# Altium project ArgoFC.PrjPcb (part 3 of 3)

## Sheet BatteryManagementSystem.SchDoc
size A4; SheetNumber: 8; SheetTotal: 13
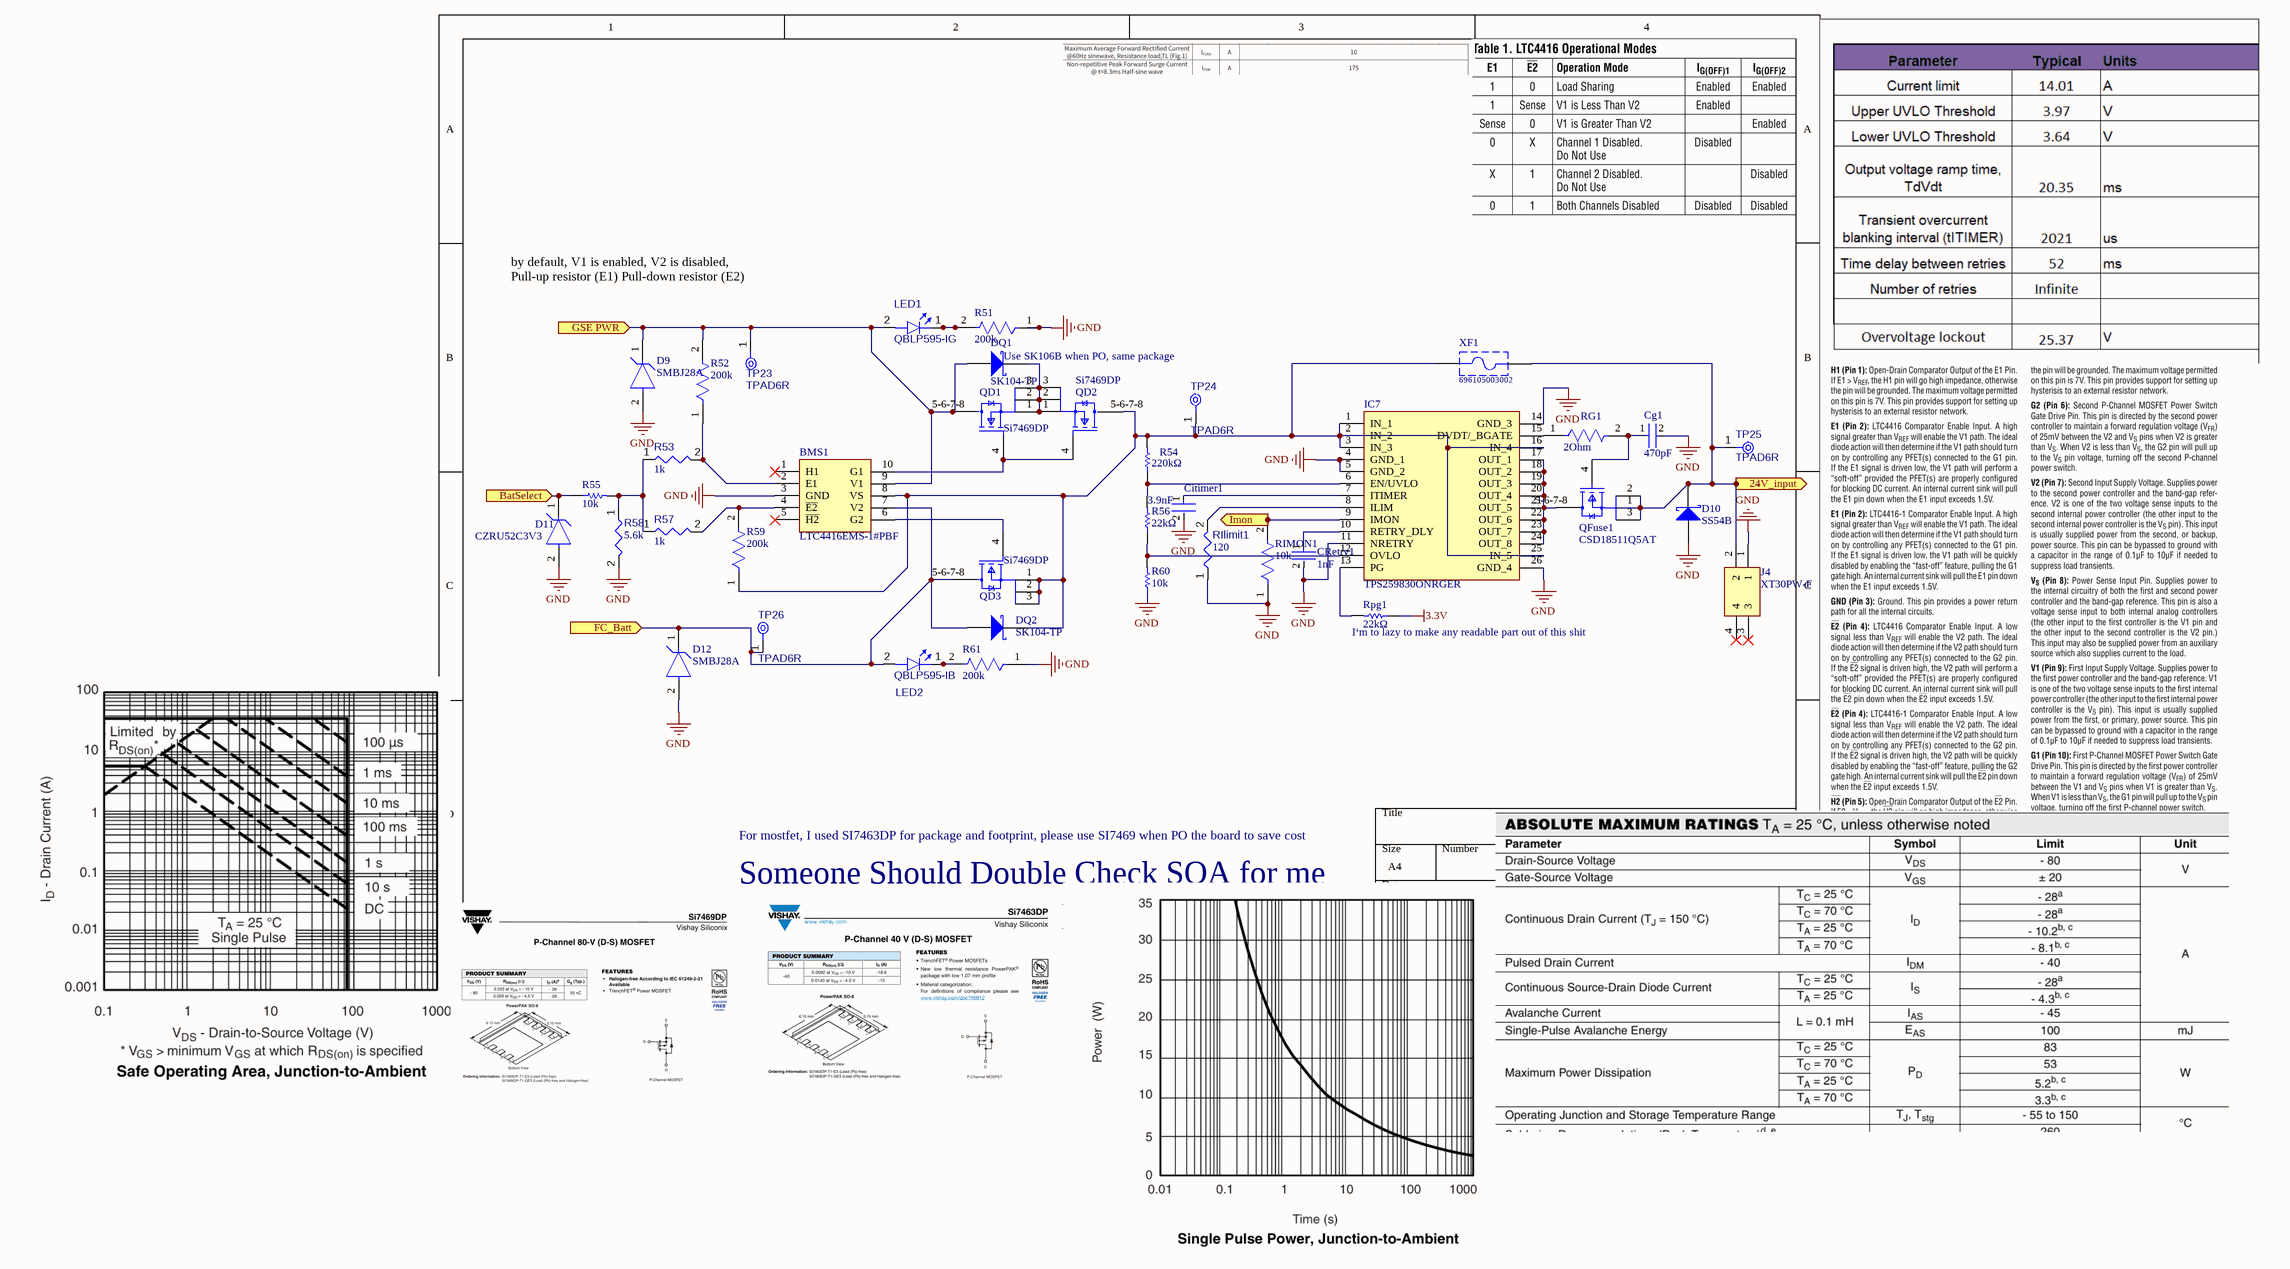
[diagram p11: BatteryManagementSystem.SchDoc]

### Parts
BMS1  LTC4416EMS-1#PBF  [SOP50P490X110-10N]
Cg1  470pF  [FP-CC0603-DA-MFG]
Citimer1  3.9nF  [FP-CC0603-DA-MFG]
CRetry1  1nF  [FP-0603-L_1_6_0_15-W_0_81-IPC_A]
D9  SMBJ28A  [FP-SMBJ-MFG]
D10  SS54B  [JCET-SMB-2_M]
D11  CZRU52C3V3  [FP-0603-SOD-523F-MFG]
D12  SMBJ28A  [FP-SMBJ-MFG]
DQ1  SK104-TP  [MCC-DO-214AB-2_V]
DQ2  SK104-TP  [MCC-DO-214AB-2_V]
IC7  TPS259830ONRGER  [TPS259830ONRGER]
J4  XT30PW-F  [XT30PWF]
LED1  QBLP595-IG  [QTB-QBLP595_V]
LED2  QBLP595-IB  [QTB-QBLP595_V]
QD1  Si7469DP  [FP-S17-0173-SINGLE-MFG]
QD2  Si7469DP  [FP-S17-0173-SINGLE-MFG]
QD3  Si7469DP  [FP-S17-0173-SINGLE-MFG]
QFuse1  CSD18511Q5AT  [FP-DQJ0008A-MFG]
R51  200k  [FP-RC0603-0_55-IPC_B]
R52  200k  [FP-RC0603-0_55-IPC_B]
R53  value 1k  [RESC1608X55X25ML10T15]  (hidden comment: Resistor 1k +/-1% 0603 100 mW)
R54  220kΩ  [RESC1608X55X30ML20T20]
R55  10k  [RESC1609X55X30LL15T15]
R56  22kΩ  [RESC1609X50X30ML10T20]
R57  value 1k  [RESC1608X55X25ML10T15]  (hidden comment: Resistor 1k +/-1% 0603 100 mW)
R58  value 5.6k  [RESC1608X55X25ML10T15]  (hidden comment: Resistor 10k +/-1% 0603 100 mW)
R59  200k  [FP-RC0603-0_55-IPC_B]
R60  10k  [RESC1609X55X30LL15T15]
R61  200k  [FP-RC0603-0_55-IPC_B]
RG1  2Ohm  [FP-CRCW2512-e3-IPC_C]
RIlimit1  value 120  [RESC0603(1608)_L]  (hidden comment: Resistor 120R +/-5 % 0603 0.1 W)
RIMON1  10k  [FP-CRCW0805-e3-IPC_A]
Rpg1  22kΩ  [RESC1609X50X30ML10T20]
TP23  TPAD6R  [TP06R]  (no BOM)
TP24  TPAD6R  [TP06R]  (no BOM)
TP25  TPAD6R  [TP06R]  (no BOM)
TP26  TPAD6R  [TP06R]  (no BOM)
XF1  696105003002  [696105003002]

### Ports
24V_input (out), BatSelect (in), FC_Batt (in), GSE PWR (in), Imon (out)

### Nets
3.3V: Rpg1.1  [project net STM32VDD]
GND: BMS1.3(GND) Cg1.2 Citimer1.2 CRetry1.2 D9.2(A) D10.1(A) D11.2(A) D12.2(A) IC7.4(GND_1) IC7.5(GND_2) IC7.11(NRETRY) IC7.14(GND_3) IC7.26(GND_4) J4.1 R51.1 R58.2 R60.1 R61.1 RIlimit1.1 RIMON1.1
NetBMS1_2: BMS1.2(E1) R52.1 R53.2
NetBMS1_4: BMS1.4(~{E2}) R57.2 R59.2
NetBMS1_6: BMS1.6(G2) QD3.4(G)
NetBMS1_7: BMS1.7(V2) D12.1(C) DQ2.1(A) LED2.2(A) QD3.5-6-7-8(D) TP26.1(TP) ; port FC_Batt
NetBMS1_8: BMS1.8(VS) DQ2.2(K) IC7.1(IN_1) IC7.2(IN_2) IC7.3(IN_3) IC7.16(IN_4) IC7.25(IN_5) QD2.5-6-7-8(D) QD3.1(S) QD3.2(S) QD3.3(S) R54.2 R59.1 TP24.1(TP) XF1.1
NetBMS1_9: BMS1.9(V1) D9.1(C) DQ1.1(A) LED1.2(A) QD1.5-6-7-8(D) R52.2 TP23.1(TP) ; port GSE PWR
NetBMS1_10: BMS1.10(G1) QD1.4(G) QD2.4(G)
NetC3_1: D10.2(K) J4.2 QFuse1.1(S) QFuse1.2(S) QFuse1.3(S) TP25.1(TP) XF1.2 ; port 24V_input
NetCg1_1: Cg1.1 QFuse1.4(G) RG1.2
NetCitimer1_1: Citimer1.1 IC7.7(ITIMER)
NetCRetry1_1: CRetry1.1 IC7.10(RETRY_DLY)
NetD11_1: D11.1(C) R55.1 ; port BatSelect
NetDQ1_2: DQ1.2(K) QD1.1(S) QD1.2(S) QD1.3(S) QD2.1(S) QD2.2(S) QD2.3(S)
NetIC7_6: IC7.6(EN/UVLO) R54.1 R56.2
NetIC7_8: IC7.8(ILIM) RIlimit1.2
NetIC7_9: IC7.9(IMON) RIMON1.2 ; port Imon
NetIC7_12: IC7.12(OVLO) R56.1 R60.2
NetIC7_13: IC7.13(PG) Rpg1.2
NetIC7_15: IC7.15(DVDT/_BGATE) RG1.1
NetIC7_17: IC7.17(OUT_1) IC7.18(OUT_2) IC7.19(OUT_3) IC7.20(OUT_4) IC7.21(OUT_5) IC7.22(OUT_6) IC7.23(OUT_7) IC7.24(OUT_8) QFuse1.5-6-7-8(D)
NetLED1_1: LED1.1(K) R51.2
NetLED2_1: LED2.1(K) R61.2
NetR53_1: R53.1 R55.2 R57.1 R58.1

Not connected (* = marked no-connect by the designer): BMS1 1(H1)* 5(~{H2})*; J4 3* 4*

### Notes on the sheet
- by default, V1 is enabled, V2 is disabled, Pull-up resistor (E1) Pull-down resistor (E2)
- (near DQ1) Use SK106B when PO, same package
- (near Rpg1) I‘m to lazy to make any readable part out of this shit
- Someone Should Double Check SOA for me
- For mostfet, I used SI7463DP for package and footprint, please use SI7469 when PO the board to save cost

### Library data of the parts
BMS1 = LTC4416EMS-1#PBF: Integrated Circuit; Manufacturer_Name: Analog Devices; Datasheet Link: https://www.analog.com/media/en/technical-documentation/data-sheets/4416fa.pdf; Height: 1.1mm; Manufacturer_Part_Number: LTC4416EMS-1#PBF; Mouser Part Number: 584-LTC4416EMS-1#PBF; Mouser Price/Stock: https://www.mouser.co.uk/ProductDetail/Analog-Devices/LTC4416EMS-1PBF?qs=hVkxg5c3xu9mDay6QbsUoQ%3D%3D; Arrow Part Number: LTC4416EMS-1#PBF; Arrow Price/Stock: https://www.arrow.com/en/products/ltc4416ems-1pbf/analog-devices?region=nac
Cg1 = CMP-03422-000635-2: CAP CER 470pF 50V X7R 0603; Tolerance: 10%; Dielectric Material: Ceramic; Capacitance: 3.9nF; Insulation Resistance: 100GR; Height: 0.8mm; Voltage Rating: 50V; Termination: SMD/SMT; REACH SVHC: No SVHC; Resistor Type: Ceramic; Radiation Hardening: No; Case Code (Imperial): 0603; Voltage: 50V; Series: CC; Mount: Surface Mount; Length: 1.6mm; RoHS Compliant: Yes; Lead Free: Lead Free; Width: 0.8mm; Package Quantity: 4000; Packaging: Tape and Reel; Dielectric: X7R; Voltage Rating (DC): 50V; Min Operating Temperature: -55°C; Depth: 0.8mm; Halogen Free: Halogen Free; Case/Package: 0603; Thickness: 0.035inch; Number of Pins: 2; Max Operating Temperature: 125°C; Case Code (Metric): 1608; Construction: Flat
Citimer1 = CMP-03422-000635-2: CAP CER 3900PF 50V X7R 0603; Tolerance: 10%; Dielectric Material: Ceramic; Insulation Resistance: 100GR; Height: 0.8mm; Voltage Rating: 50V; Termination: SMD/SMT; REACH SVHC: No SVHC; Resistor Type: Ceramic; Radiation Hardening: No; Case Code (Imperial): 0603; Voltage: 50V; Series: CC; Mount: Surface Mount; Length: 1.6mm; RoHS Compliant: Yes; Lead Free: Lead Free; Capacitance: 3.9nF; Width: 0.8mm; Package Quantity: 4000; Packaging: Tape and Reel; Dielectric: X7R; Voltage Rating (DC): 50V; Min Operating Temperature: -55°C; Depth: 0.8mm; Halogen Free: Halogen Free; Case/Package: 0603; Thickness: 0.035inch; Number of Pins: 2; Max Operating Temperature: 125°C; Case Code (Metric): 1608; Construction: Flat
CRetry1 = CMP-2006-04378-2: General Purpose Ceramic Capacitor, 0603, 1nF, 10%, X7R, 15%, 50V; Case Code (Metric): 1608; Min Operating Temperature: -55°C; Weight: 7.1E-05oz; Series: -; Capacitance: 1nF; RoHS Compliant: Yes; Radiation Hardening: No; Height: 0.9mm; Mount: Surface Mount; REACH SVHC: No SVHC; Lead Free: Lead Free; Depth: 0.81mm; Voltage: 50V; Number of Pins: 2; Voltage Rating: 50V; Max Operating Temperature: 125°C; Termination: SMD/SMT; Construction: Flat; Case Code (Imperial): 0603; Dielectric: X7R; Width: 0.032inch; Tolerance: 10%; Case/Package: 0603; Contact Plating: Tin; Packaging: Tape and Reel; Voltage Rating (DC): 50V; Dielectric Material: Ceramic; Package Quantity: 4000; Thickness: 0.035inch; Length: 1.6mm
D9 D12 = CMP-08607-000081-1: TVS DIODE 28V 45.4V DO214AA; Manufacturer: Littelfuse Inc; Breakdown Voltage: 31.1V; Direction: Unidirectional; Number Of Channels: 1; Peak Pulse Power: 600W; Max Junction Temp: +150°C; Peak Pulse Current: 13.3A; Temperature: -65°C to +150°C; Category: Diode; RoHS: TRUE; Height: 2.61mm; Reverse Standoff Voltage: 28V; Device Class L1: Circuit Protection; Temperature Range Low: -65°C; ComponentLink2Description: Datasheet; Digikey Description: TVS DIODE 28V 45.4V DO214AA; Automotive: No; Package: SMBJ; Mouser Description: Littelfuse SMBJ28A, Uni-Directional TVS Diode, 600W, 2-Pin DO-214AA; ComponentLink2URL: https://www.littelfuse.com/~/media/electronics/datasheets/tvs_diodes/littelfuse_tvs_diode_smbj_datasheet.pdf.pdf; Manufacturer Part Number: SMBJ28A; Octopart: https://octopart.com/smbj28a-littelfuse-350790; Clamping Voltage: 45.4V; Temperature Range High: +150°C; Device Class L3: unset; Device Class L2: TVS Diodes; Lead Free: Yes
D10 = CMP-004-00006-2: Schottky Barrier Rectifier, 40 V, 5 A, -55 to 150 degC, 2-Pin SMD; Manufacturer: JCET; Datasheet URL: http://wiki.seeedstudio.com/images/3/3f/0310130P1.pdf; Datasheet Version: May-13; Package Reference: SMB-2; RoHS Compliant: Unknown; Manufacturer URL: http://www.cj-elec.com/; Mounting Technology: SM; Package Description: 2-Pin Surface Mount Device, Body 4.315 x 3.62 mm; Case/Package: SMB-2
D11 = CMP-20229-000003-1: DIODE ZENER 3.3V 150MW 0603; Zener Current: 5mA; Tolerance: 5%; Output Current: 500mA; Impedance: 95R; Element Configuration: Single; Max Reverse Leakage Current: 25uA; Max Operating Temperature: 125°C; Max Power Dissipation: 150mW; Power Rating: 150mW; Lead Free: Lead Free; Mount: Surface Mount; Packaging: Tape and Reel; Voltage Tolerance: 5%; Power Dissipation: 150mW; Zener Voltage: 3.3V; Min Operating Temperature: -55°C; Case/Package: SMD/SMT; Voltage Rating (DC): 3.3V; Package Quantity: 1
DQ1 DQ2 = CMP-2000-05214-1: Schottky Rectifier, 40 V, 10 A, -55 to 125 degC, 2-Pin SMD, RoHS, Tape and Reel; Manufacturer: Micro Commercial Components; Max Surge Current: 250A; Maximum Reverse Leakage Current: 1mA; Peak Reverse Voltage: 40V; Forward Continuous Current: 10A; Mounting Style: SMD/SMT; Product: SchottkyRectifiers; Manufacturer URL: http://www.mccsemi.com/; Datasheet URL: https://datasheet.ciiva.com/4718/sk102-sk1010hsmc-27683-4718371.pdf; Datasheet Version: Rev. B, 05/2012; RoHS: Details; Packaging: Reel; Package / Case: DO-214AB; Operating Temperature Range: -55Cto+125C
IC7 = TPS259830ONRGER: Integrated Circuit; Manufacturer_Name: Texas Instruments; Datasheet Link: https://www.ti.com/lit/gpn/tps25983; Height: 1mm; Manufacturer_Part_Number: TPS259830ONRGER; Mouser Part Number: 595-TPS259830ONRGER; Mouser Price/Stock: https://www.mouser.co.uk/ProductDetail/Texas-Instruments/TPS259830ONRGER?qs=ST9lo4GX8V2yYPVZTyti6w%3D%3D; Arrow Part Number: TPS259830ONRGER; Arrow Price/Stock: https://www.arrow.com/en/products/tps259830onrger/texas-instruments?utm_currency=USD&region=nac
J4 = XT30PW-F: Connector; Manufacturer_Name: Amass; Datasheet Link: https://www.tme.eu/Document/ce4077e36b79046da520ca73227e15de/XT30PW%20SPEC.pdf; Height: 5mm; Manufacturer_Part_Number: XT30PW-F
LED1 = CMP-007-00041-3: Chip LED 0402, Green, 0.02 A, 3.1 to 3.7 V, -40 to 80 degC, 2-Pin SMD, RoHS, Tape and Reel; Case/Package: 0402; Colour: Green; Mounting Technology: SMT; Pins: 2; RoHS Compliant: Yes
LED2 = CMP-007-00042-3: Chip LED 0402, Blue, 0.02 A, 3.1 to 3.7 V, -40 to 80 degC, 2-Pin SMD, RoHS, Tape and Reel; RoHS Compliant: Yes; Colour: Blue; Pins: 2; Case/Package: 0402; Mounting Technology: SMT
QD1 QD3 = CMP-02550-000199-1: Use Si7469DP For PCBA. MOSFET P-CH 40V 11A PPAK SO-8; Manufacturer: Vishay; Manufacturer Part Number: SI7463DP-T1-E3; Depletion Mode: False; Number Of Channels: 1; Pulse Drain Current: -60A; Typ Forward Diode Voltage: -0.8V; Drain To Source Voltage: -40V; Rthja Max: 52°C/W; Turn On Delay Time: 20ns; Continuous Drain Current: -11A; Max Junction Temp: +150°C; Gate Charge At Vgs: 121nC @ -10V; Max Forward Diode Voltage: -1.2V; Reverse Recovery Time: 45ns; Gate To Source Voltage: 20V; Threshold Vgs Min: -1V; Standoff Height: 0mm; Turn Off Delay Time: 200ns; Threshold Vgs Max: -3V; Transconductance: 50S; Drain To Source Resistance: 0.0075Ω; Power Dissipation: 1.9W; Temperature Range Low: -55°C; Lead Free: Yes; Device Class L3: MOSFETs; Automotive: No; Digikey Description: MOSFET P-CH 40V 11A PPAK SO-8; ComponentLink2Description: Datasheet; Octopart: https://octopart.com/si7463dp-t1-e3-vishay-42065245; Number Of P Channels: 1; Device Class L1: Discrete Semiconductors; ComponentLink2URL: http://www.vishay.com/docs/72440/si7463dp.pdf; Device Class L2: Transistors; RoHS: TRUE; Category: Trans; Mouser Description: MOSFET 40V 18.6A 5.4W 9.2mohm @ 10V; Package: S17-0173-SINGLE; Height: 1.17mm; Temperature Range High: +150°C; Temperature: -55°C to +150°C
QD2 = CMP-02550-000199-1: MOSFET P-CH 40V 11A PPAK SO-8; Manufacturer: Vishay; Manufacturer Part Number: SI7463DP-T1-E3; Depletion Mode: False; Number Of Channels: 1; Pulse Drain Current: -60A; Typ Forward Diode Voltage: -0.8V; Drain To Source Voltage: -40V; Rthja Max: 52°C/W; Turn On Delay Time: 20ns; Continuous Drain Current: -11A; Max Junction Temp: +150°C; Gate Charge At Vgs: 121nC @ -10V; Max Forward Diode Voltage: -1.2V; Reverse Recovery Time: 45ns; Gate To Source Voltage: 20V; Threshold Vgs Min: -1V; Standoff Height: 0mm; Turn Off Delay Time: 200ns; Threshold Vgs Max: -3V; Transconductance: 50S; Drain To Source Resistance: 0.0075Ω; Power Dissipation: 1.9W; Temperature Range Low: -55°C; Lead Free: Yes; Device Class L3: MOSFETs; Automotive: No; Digikey Description: MOSFET P-CH 40V 11A PPAK SO-8; ComponentLink2Description: Datasheet; Octopart: https://octopart.com/si7463dp-t1-e3-vishay-42065245; Number Of P Channels: 1; Device Class L1: Discrete Semiconductors; ComponentLink2URL: http://www.vishay.com/docs/72440/si7463dp.pdf; Device Class L2: Transistors; RoHS: TRUE; Category: Trans; Mouser Description: MOSFET 40V 18.6A 5.4W 9.2mohm @ 10V; Package: S17-0173-SINGLE; Height: 1.17mm; Temperature Range High: +150°C; Temperature: -55°C to +150°C
QFuse1 = CMP-04962-000088-1: MOSFET N-CH 40V 159A 8VSON; Rds On Max: 3.5mR; Element Configuration: Single; Max Power Dissipation: 104W; Input Capacitance: 5.85nF; Mount: Surface Mount; Min Operating Temperature: -55°C; Packaging: Tape and Reel; Number of Pins: 8; RoHS Compliant: Yes; Continuous Drain Current (ID): 159A; Max Operating Temperature: 150°C; Drain to Source Voltage (Vdss): 40V
R51 R52 R59 R61 = CMP-03412-037786-1: RES SMD 200K OHM 1% 1/10W 0603; Temperature Coefficient: 100ppm/°C; Voltage Rating: 50V; Resistance: 200kR; Max Power Dissipation: 100mW; Packaging: Tape and Reel; REACH SVHC: No SVHC; Resistance Tolerance: 1%; Number of Pins: 2; Width: 0.031inch; Termination: SMD/SMT; Features: Moisture Resistant; Tolerance: 1%; Series: RC; Case Code (Imperial): 0603; Depth: 0.8mm; Number of Terminations: 2; Max Operating Temperature: 155°C; Resistor Type: Thick Film; Height: 0.022inch; Lead Free: Lead Free; Construction: Rectangular; Case/Package: 0603; Power Rating: 100mW; Case Code (Metric): 1608; Length: 1.6mm; Size Code: 0603; RoHS Compliant: Yes; Military Standard: Not; Min Operating Temperature: -55°C; Package Quantity: 1; Voltage Rating (DC): 50V
R53 R57 = CMP-009-00014-5: Chip Resistor, 1 KOhm, +/-1%, 0.1 W, -55 to 155 degC, 0603 (1608 Metric); Voltage Rating: 50V; Power: 100mW; Tolerance: 1%; Mounting Technology: SM; Pins: 2; Case/Package: 0603; Min Operating Temperature: -55°C; RoHS Compliant: True; Max Operating Temperature: 155°C
R54 = CMP-2000-00054-1: Fixed Resistor, Thin Film, 0.1W, 210000ohm, 75V, 0.1% +/-Tol, 25ppm/Cel, Surface Mount, 0603; Part Number: ERA3AEB392V; Manufacturer: Panasonic
R55 R60 = CMP-1012-00623-3: Chip Resistor, 10 KOhm, +/- 1%, 0.1 W, -55 to 155 degC, 0603 (1608 Metric), RoHS, Tape and Reel; Manufacturer: Panasonic; Voltage Rating: 75V; Case\/Package: 0603; Power Rating: 100mW; Resistance: 10KOhm; Temperature Coefficient: 100ppm\/degreesC; Number of Pins: 2; Package Reference: 603; Depth: 0.8mm; Mount: SurfaceMount; Package Description: 2-Pin Surface Mount Device, Body 1.6 x 0.85 mm; Datasheet Version: 02/2017; Length: 1.6mm; Lead Free: LeadFree; Height: 0.45mm; Number of Terminations: 2; Max Power Dissipation: 100mW; Min Operating Temperature: -55degC; Datasheet URL: https://industrial.panasonic.com/cdbs/www-data/pdf/RDA0000/AOA0000C304.pdf; Termination: SMD/SMT; Case Code (Metric): 1608; Case Code (Imperial): 0603; Tolerance: 1%; Max Operating Temperature: 155degC; RoHSCompliant: true; Voltage Rating (DC): 75V; Radiation Hardening: No; Packaging: TapeandReel; Composition: ThickFilm; Mounting Technology: SurfaceMount; Manufacturer URL: http://www.panasonic.com/; Width: 0.031inch; REACH SVHC: NoSVHC; Contact Plating: Tin; Military Standard: Not; Package Quantity: 1
R56 Rpg1 = CMP-2000-02954-1: Fixed Resistor, Metal Glaze/thick Film, 0.1W, 18000ohm, 75V, 1% +/-Tol, 100ppm/Cel, Surface Mount, 0603; Part Number: CRCW0603182KFKEA; Manufacturer: Vishay Dale
R58 = CMP-009-00017-5: Chip Resistor, 10 KOhm, +/- 1%, 01 W, -55 to 155 degC, 0603 (1608 Metric); Voltage Rating: 50V; Power: 100mW; RoHS Compliant: True; Min Operating Temperature: -55°C; Pins: 2; Case/Package: 0603; Mounting Technology: SM; Max Operating Temperature: 155°C; Tolerance: 1%
RG1 = CMP-02407-006382-1: RES Thick Film, 2Ω, 5%, 1W, 200ppm/°C, 2512; Voltage Rating (DC): 500V; Resistance: 2R; Max Power Dissipation: 1W; Case Code (Imperial): 2512; Depth: 3.15mm; Tolerance: 5%; Temperature Coefficient: 200ppm/°C; Lead Free: Lead Free; Length: 6.3mm; Number of Pins: 2; Military Standard: Not; Min Operating Temperature: -55°C; Height: 0.6mm; Packaging: Tape and Reel; Contact Plating: Tin; Power Rating: 1W; Number of Terminations: 2; Package Quantity: 1; Weight: 0.001429oz; Case Code (Metric): 6432; Termination: SMD/SMT; Features: Automotive AEC-Q200; Radiation Hardening: No; Case/Package: 2512; Composition: Thick Film; Voltage Rating: 500V; Width: 0.124inch; Max Operating Temperature: 155°C
RIlimit1 = CMP-009-00176-3: Chip Resistor, 120 Ohms, +/-5 %, 0.1 W, -55 to 155 degC, 0603; Power: 100mW; Tolerance: 5%; Max Operating Temperature: 155°C; Pins: 2; Case/Package: 0603; Min Operating Temperature: -55°C
RIMON1 = CMP-2001-04908-2: RES Thick Film, 10kΩ, 1%, 0.125W, 100ppm/°C, 0805; Resistance: 10kR; Voltage Rating (DC): 150V; Power Rating: 125mW; Weight: 0.000194oz; Package Quantity: 5000; Military Standard: Not; Max Operating Temperature: 155°C; Temperature Coefficient: 100ppm/°C; Contact Plating: Tin; Width: 1.25mm; Height: 0.45mm; Radiation Hardening: No; Tolerance: 1%; Min Operating Temperature: -55°C; Voltage Rating: 150V; Length: 2mm; Depth: 1.25mm; Termination: SMD/SMT; Packaging: Tape and Reel; Case/Package: 0805; Case Code (Metric): 2012; Lead Free: Lead Free; Case Code (Imperial): 0805; Composition: Thick Film
TP23-TP26 = CMP-00028-00002-2: 0.6mm round; Pins: 1
XF1 = CMP-1502-00234-1: WR-FSH Fuse Holder Blocks Fuse Holder Blocks Clip Cover for PCB; Manufacturer: Wurth Elektronik; Fuse Size: 5x20mm; Mounting Technology: THT; Publisher: WurthElektronik; Manufacturer URL: http://www.we-online.de; Package Reference: 696105003002; Part Number: 696105003002; Packaging: Box; Datasheet URL: https://katalog.we-online.de/em/datasheet/696105003002.pdf; Operating Temperature: -30to120degC

## Sheet CAN_Module.SchDoc
size A4; SheetNumber: 9; SheetTotal: 13
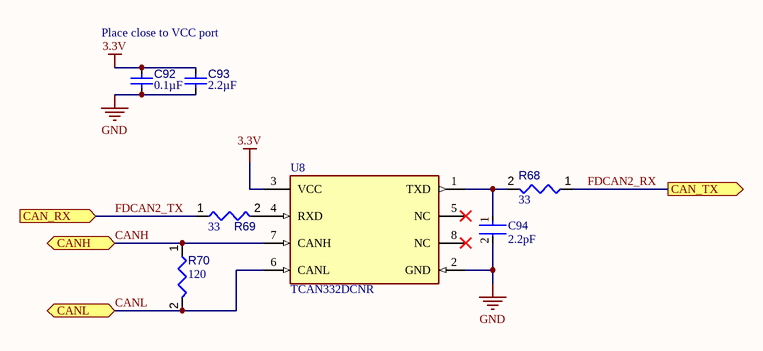
[diagram p12: CAN_Module.SchDoc]

### Parts
C92  value 0.1µF  [CAPC0603(1608)100_L]  (hidden comment: Capacitor 10µF +/-20% 10V 0603)
C93  value 2.2µF  [CAPC0603(1608)100_L]  (hidden comment: Capacitor 10µF +/-20% 10V 0603)
C94  2.2pF  [FP-C0603C-CF-MFG]
R68  value 33  [RESC1609X50X30ML08T20]  (hidden comment: Resistor 22R +/-1% 0603 100 mW)
R69  value 33  [RESC1609X50X30ML08T20]  (hidden comment: Resistor 22R +/-1% 0603 100 mW)
R70  value 120  [RESC1609X50X30ML08T20]  (hidden comment: Resistor 20R +/-1% 0603 100 mW)
U8  TCAN332DCNR  [FP-DCN0008A-IPC_A]

### Ports
CAN_RX (in), CAN_TX (out), CANH (bidir), CANL (bidir)

### Nets
3.3V: C92.1 C93.1 U8.3(VCC)  [project net STM32VDD]
GND: C92.2 C93.2 C94.2 U8.2(GND)
CANH: R70.1 U8.7(CANH) ; port CANH
CANL: R70.2 U8.6(CANL) ; port CANL
FDCAN2_RX: R68.1 ; port CAN_TX
FDCAN2_TX: R69.1 ; port CAN_RX
NetC94_1: C94.1 R68.2 U8.1(TXD)
NetR69_2: R69.2 U8.4(RXD)

Not connected (* = marked no-connect by the designer): U8 5(NC)* 8(NC)*

### Notes on the sheet
- Place close to VCC port

### Library data of the parts
C92 C93 = CMP-001-00075-6: Chip Capacitor, 10µF +/-20%, 10V, 0603, Thickness 1 mm; Tolerance: 10%; Mounting Technology: SMT; Case/Package: 0603; Max Operating Temperature: 85°C; Voltage Rating: 10V; Pins: 2; Min Operating Temperature: -55°C
C94 = CMP-1035-00158-3: CAP CER 2.2PF 50V NP0 0603; Manufacturer Part Number: C0603C229C5GACTU; Manufacturer: KEMET; Automotive Grade: Grade 1; Temperature Coefficient: 30ppm/°C; Description: C0603 2.2 pF C0G 30ppm/°C 0.25 pF 50 V; Temperature Characteristic: C0G; Tolerance: 0.25 pF; Material: Ceramic; Lead Free: Yes; Value: 2.2 pF; Voltage Rating: 50 V; Package: C0603C-CF; Category: Cap; RoHS: TRUE; ComponentLink2Description: Datasheet; Capacitance: 2.2 pF; Device Class L2: Capacitors; Digikey Description: CAP CER 2.2PF 50V NP0 0603; Temperature: -55°C to +125°C; Temperature Range Low: -55°C; Mouser Description: Multilayer Ceramic Capacitors MLCC - SMD/SMT 50volts 2.2pF C0G 0.25%; ComponentLink2URL: https://api.kemet.com/component-edge/download/datasheet/C0603C100J5GACAUTO.pdf; Temperature Range High: +125°C; Height: 0.87mm; Automotive: Yes; Device Class L1: Passive Components; Octopart: https://octopart.com/c0603c229c5gactu-kemet-3874912; Device Class L3: Ceramic Capacitors
R68 R69 = CMP-009-00027-5: Chip Resistor, 22 Ohm, +/- 1%, 100 mW, -55 to 155 degC, 0603 (1608 Metric); Power: 100mW; Voltage Rating: 75V; Max Operating Temperature: 155°C; Min Operating Temperature: -55°C; Tolerance: 1%; RoHS Compliant: True; Mounting Technology: SM; Case/Package: 0603; Pins: 2
R70 = CMP-009-00199-1: Chip Resistor, 20 Ohm, +/- 1%, 100 mW, -55 to 155 degC, 0603 (1608 Metric); Power: 100mW; Voltage Rating: 75V; RoHS Compliant: True; Tolerance: 1%; Mounting Technology: SM; Min Operating Temperature: -55°C; Pins: 2; Max Operating Temperature: 155°C; Case/Package: 0603
U8 = CMP-04872-000203-1: IC TRANSCEIVER 1/1 SOT23-8; Receiver Hysteresis: 120mV; Packaging: Tape and Reel; Mount: Surface Mount; RoHS Compliant: Yes; Min Operating Temperature: -40°C; Case/Package: SOT-23-8; Lead Free: Lead Free; Max Operating Temperature: 125°C

## Sheet KSZ8863EthernetSwitch_RMII.SchDoc
size 420 x 297 mm; SheetNumber: 6; SheetTotal: 13
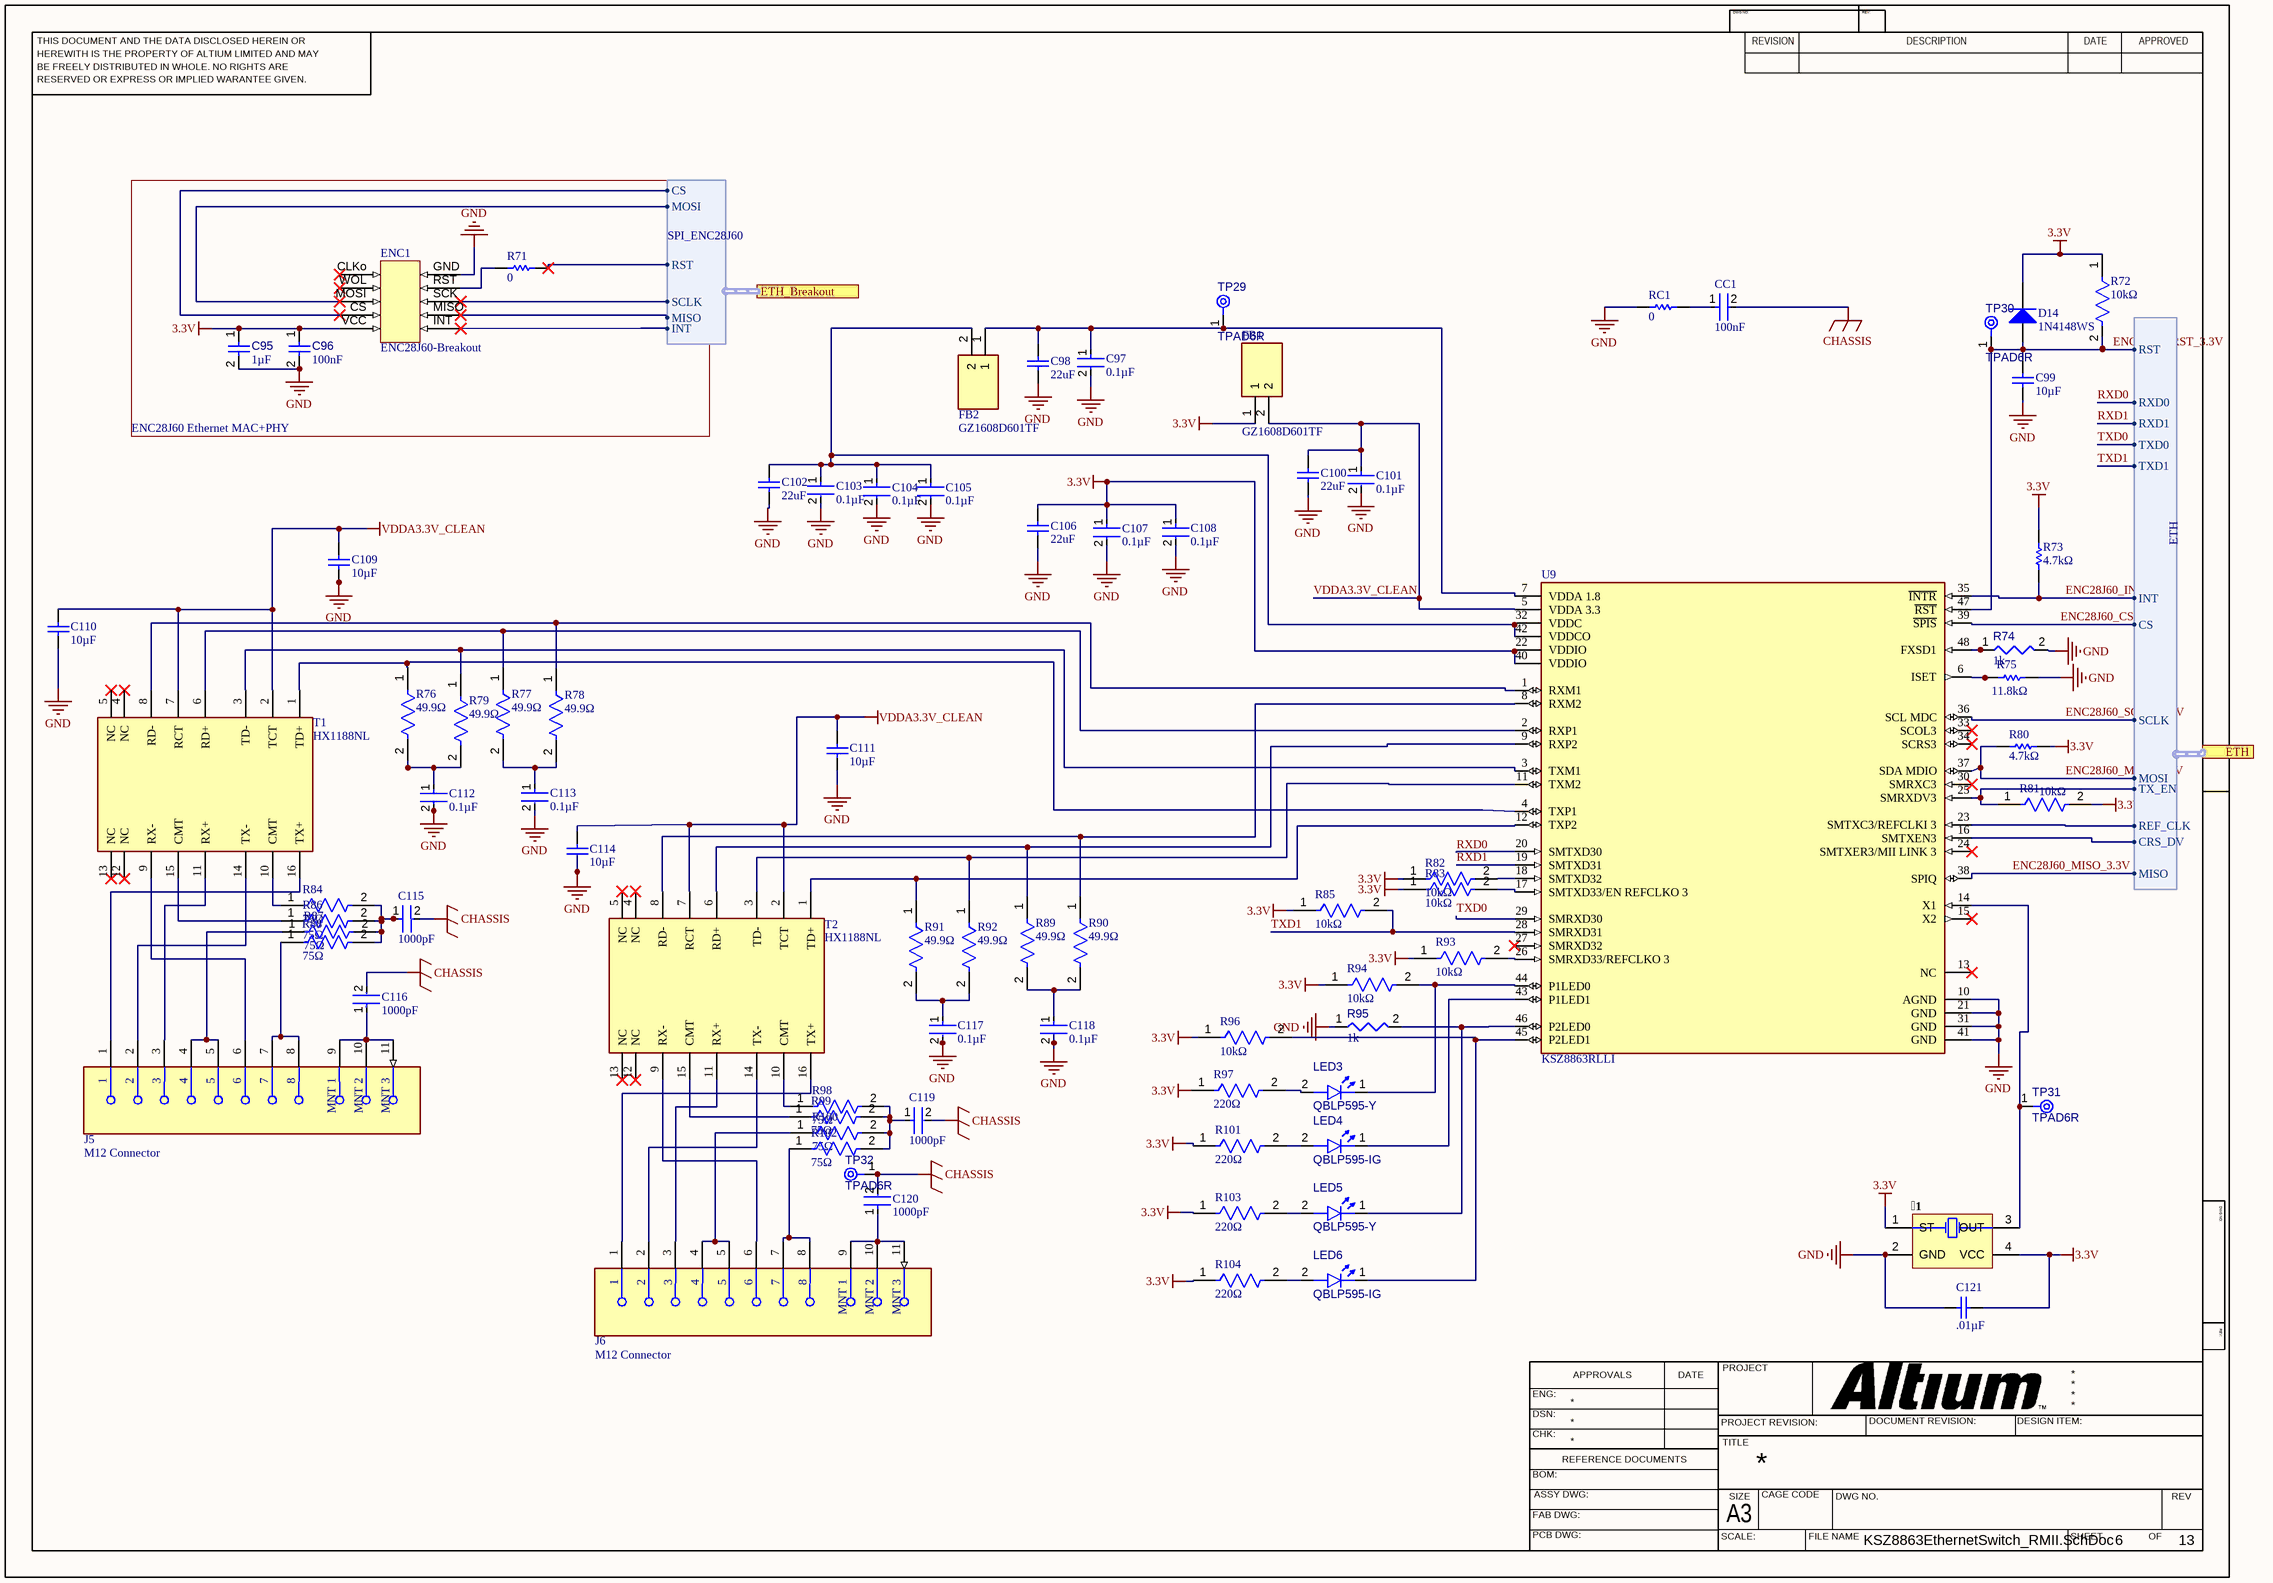
[diagram p13: KSZ8863EthernetSwitch_RMII.SchDoc]

### Parts
1  (no value)  [ABRA-ABM3B-4_V]
C95  value 1µF  [CAPC2013X135X45NL10T25]  (hidden comment: Capacitor 1 uF +/- 10% 50 V 0805)
C96  value 100nF  [CAPC2013X95X50LL10T25]  (hidden comment: Capacitor 100 nF +/-10% 50 V 0805)
C97  0.1µF  [FP-CC0402-MFG]
C98  22uF  [CAPC1210(3225)280_L]
C99  10µF  [CAPC1206(3216)190_L]
C100  22uF  [CAPC1210(3225)280_L]
C101  0.1µF  [FP-CC0402-MFG]
C102  22uF  [CAPC1210(3225)280_L]
C103  0.1µF  [FP-CC0402-MFG]
C104  0.1µF  [FP-CC0402-MFG]
C105  0.1µF  [FP-CC0402-MFG]
C106  22uF  [CAPC1210(3225)280_L]
C107  0.1µF  [FP-CC0402-MFG]
C108  0.1µF  [FP-CC0402-MFG]
C109  10µF  [CAPC1206(3216)190_L]
C110  10µF  [CAPC1206(3216)190_L]
C111  10µF  [CAPC1206(3216)190_L]
C112  0.1µF  [FP-CC0402-MFG]
C113  0.1µF  [FP-CC0402-MFG]
C114  10µF  [CAPC1206(3216)190_L]
C115  1000pF  [FP-C1206C-EF-MFG]
C116  1000pF  [FP-C1206C-EF-MFG]
C117  0.1µF  [FP-CC0402-MFG]
C118  0.1µF  [FP-CC0402-MFG]
C119  1000pF  [FP-C1206C-EF-MFG]
C120  1000pF  [FP-C1206C-EF-MFG]
C121  .01µF  [CAPC0603X33X15NL03T05]
CC1  100nF  [FP-1210-L_3_3_0_4-W_2_5_0-MFG]
D14  1N4148WS  [DIOD-SOD323-2-A_V]
ENC1  ENC28J60-Breakout  [New footprint 1]
FB1  GZ1608D601TF  [BEADC1608X95N]
FB2  GZ1608D601TF  [BEADC1608X95N]
J5  M12 Connector  [FP-1424177-MFG]
J6  M12 Connector  [FP-1424177-MFG]
LED3  QBLP595-Y  [QTB-QBLP595_V]
LED4  QBLP595-IG  [QTB-QBLP595_V]
LED5  QBLP595-Y  [QTB-QBLP595_V]
LED6  QBLP595-IG  [QTB-QBLP595_V]
R71  value 0  [RESC3216X60X45ML15T20]  (hidden comment: Resistor 0R +/- 5% 1206 250 mW)
R72  10kΩ  [FP-AC0603-MFG]
R73  4.7kΩ  [RESC2013X60X40ML20T25]
R74  value 1k  [RESC1608X55X25ML10T15]  (hidden comment: Resistor 1k +/-1% 0603 100 mW)
R75  11.8kΩ  [RESC2013X70X40NL20T20]
R76  49.9Ω  [FP-RT0603-MFG]
R77  49.9Ω  [FP-RT0603-MFG]
R78  49.9Ω  [FP-RT0603-MFG]
R79  49.9Ω  [FP-RT0603-MFG]
R80  4.7kΩ  [RESC2013X60X40ML20T25]
R81  10kΩ  [FP-AC0603-MFG]
R82  10kΩ  [FP-AC0603-MFG]
R83  10kΩ  [FP-AC0603-MFG]
R84  75Ω  [FP-RT0603-MFG]
R85  10kΩ  [FP-AC0603-MFG]
R86  75Ω  [FP-RT0603-MFG]
R87  75Ω  [FP-RT0603-MFG]
R88  75Ω  [FP-RT0603-MFG]
R89  49.9Ω  [FP-RT0603-MFG]
R90  49.9Ω  [FP-RT0603-MFG]
R91  49.9Ω  [FP-RT0603-MFG]
R92  49.9Ω  [FP-RT0603-MFG]
R93  10kΩ  [FP-AC0603-MFG]
R94  10kΩ  [FP-AC0603-MFG]
R95  value 1k  [RESC1608X55X25ML10T15]  (hidden comment: Resistor 1k +/-1% 0603 100 mW)
R96  10kΩ  [FP-AC0603-MFG]
R97  220Ω  [FP-RT0603-MFG]
R98  75Ω  [FP-RT0603-MFG]
R99  75Ω  [FP-RT0603-MFG]
R100  75Ω  [FP-RT0603-MFG]
R101  220Ω  [FP-RT0603-MFG]
R102  75Ω  [FP-RT0603-MFG]
R103  220Ω  [FP-RT0603-MFG]
R104  220Ω  [FP-RT0603-MFG]
RC1  value 0  [RESC2013X50X35ML15T15]  (hidden comment: Resistor 0R +/- 1% 0805 125 mW)
T1  HX1188NL  [FP-HX1188NL-MFG]
T2  HX1188NL  [FP-HX1188NL-MFG]
TP29  TPAD6R  [TP06R]  (no BOM)
TP30  TPAD6R  [TP06R]  (no BOM)
TP31  TPAD6R  [TP06R]  (no BOM)
TP32  TPAD6R  [TP06R]  (no BOM)
U9  KSZ8863RLLI  [FP-LQFP7x7-48LD-PL-1-IPC_B]

### Blocks framed on the sheet
ENC28J60 Ethernet MAC+PHY: C95 C96 ENC1 R71

### Ports
ETH (harness ETH), ETH_Breakout (harness SPI_ENC28J60)

### Harnesses
ETH: CS, SCLK, MOSI, MISO, INT, RST, TX_EN, REF_CLK, CRS_DV, RXD0, RXD1, TXD0, TXD1
SPI_ENC28J60: CS, MOSI, RST, SCLK, INT, MISO

### Nets
3.3V: 1.1(ST) 1.4(VCC) C95.1 C96.1 C106.2 C107.1 C108.1 C121.2 D14.2(K) ENC1.VCC FB1.1 R72.1 R73.2 R80.2 R81.2 R82.1 R83.1 R85.1 R93.1 R94.1 R96.1 R97.1 R101.1 R103.1 R104.1 U9.22(VDDIO) U9.40(VDDIO)  [project net STM32VDD]
CHASSIS: C115.2 C116.2 C119.2 C120.2 CC1.2 TP32.1(TP)
GND: 1.2(GND) C95.2 C96.2 C97.2 C98.1 C99.1 C100.1 C101.2 C102.2 C103.2 C104.2 C105.2 C106.1 C107.2 C108.2 C109.1 C110.1 C111.1 C112.2 C113.2 C114.1 C117.2 C118.2 C121.1 ENC1.GND R74.2 R75.2 R95.1 RC1.1 U9.10(AGND) U9.21(GND) U9.31(GND) U9.41(GND)
VDDA3.3V_CLEAN: C100.2 C101.1 C109.2 C110.2 C111.2 C114.2 FB1.2 T1.2(TCT) T1.7(RCT) T2.2(TCT) T2.7(RCT) U9.5(VDDA_3.3)
ENC28J60_CS_3.3V: ENC1.CS ; port ETH_Breakout.CS
ENC28J60_CS_3.3V: U9.39(~{SPIS})  [a separate net that carries the same name]
ENC28J60_INT_3.3V: ENC1.INT ; port ETH_Breakout.INT
ENC28J60_INT_3.3V: R73.1 U9.35(~{INTR})  [a separate net that carries the same name]
ENC28J60_MISO_3.3V: ENC1.MISO ; port ETH_Breakout.MISO
ENC28J60_MISO_3.3V: U9.38(SPIQ)  [a separate net that carries the same name]
ENC28J60_MOSI_3.3V: ENC1.MOSI ; port ETH_Breakout.MOSI
ENC28J60_MOSI_3.3V: R80.1 U9.37(SDA_MDIO)  [a separate net that carries the same name]
ENC28J60_RST_3.3V: R71.2 ; port ETH_Breakout.RST
ENC28J60_RST_3.3V: C99.2 D14.1(A) R72.2 TP30.1(TP) U9.47(~{RST})  [a separate net that carries the same name]
ENC28J60_SCLK_3.3V: U9.36(SCL_MDC)
ETH_CRS_DV: U9.16(SMTXEN3) ; port ETH.CRS_DV
ETH_REF_CLK: U9.23(SMTXC3/REFCLKI_3) ; port ETH.REF_CLK
ETH_TX_EN: R81.1 U9.25(SMRXDV3) ; port ETH.TX_EN
RXD0: U9.20(SMTXD30) ; port ETH.RXD0  [project net ETH_RXD0]
RXD1: U9.19(SMTXD31) ; port ETH.RXD1  [project net ETH_RXD1]
TXD0: U9.29(SMRXD30) ; port ETH.TXD0  [project net ETH_TXD0]
TXD1: R85.2 U9.28(SMRXD31) ; port ETH.TXD1  [project net ETH_TXD1]
Net1_3: 1.3(OUT) TP31.1(TP) U9.14(X1)
NetC97_1: C97.1 C98.2 FB2.1 TP29.1(TP) U9.7(VDDA_1.8)
NetC102_1: C102.1 C103.1 C104.1 C105.1 FB2.2 U9.32(VDDC) U9.42(VDDCO)
NetC112_1: C112.1 R76.2 R79.2
NetC113_1: C113.1 R77.2 R78.2
NetC115_1: C115.1 R84.2 R86.2 R87.2 R88.2
NetC116_1: C116.1 J5.9(MNT_1) J5.10(MNT_2) J5.11(MNT_3)
NetC117_1: C117.1 R91.2 R92.2
NetC118_1: C118.1 R89.2 R90.2
NetC119_1: C119.1 R98.2 R99.2 R100.2 R102.2
NetC120_1: C120.1 J6.9(MNT_1) J6.10(MNT_2) J6.11(MNT_3)
NetCC1_1: CC1.1 RC1.2
NetENC1_RST: ENC1.RST R71.1
NetJ5_1: J5.1 T1.16(TX+)
NetJ5_2: J5.2 T1.14(TX-)
NetJ5_3: J5.3 T1.11(RX+)
NetJ5_4: J5.4 J5.5 R87.1
NetJ5_6: J5.6 T1.9(RX-)
NetJ5_7: J5.7 J5.8 R88.1
NetJ6_1: J6.1 T2.16(TX+)
NetJ6_2: J6.2 T2.14(TX-)
NetJ6_3: J6.3 T2.11(RX+)
NetJ6_4: J6.4 J6.5 R100.1
NetJ6_6: J6.6 T2.9(RX-)
NetJ6_7: J6.7 J6.8 R102.1
NetLED3_1: LED3.1(K) R94.2 U9.44(P1LED0)
NetLED3_2: LED3.2(A) R97.2
NetLED4_1: LED4.1(K) U9.43(P1LED1)
NetLED4_2: LED4.2(A) R101.2
NetLED5_1: LED5.1(K) R95.2 U9.46(P2LED0)
NetLED5_2: LED5.2(A) R103.2
NetLED6_1: LED6.1(K) R96.2 U9.45(P2LED1)
NetLED6_2: LED6.2(A) R104.2
NetR74_1: R74.1 U9.48(FXSD1)
NetR75_1: R75.1 U9.6(ISET)
NetR76_1: R76.1 T1.1(TD+) U9.4(TXP1)
NetR77_1: R77.1 T1.6(RD+) U9.2(RXP1)
NetR78_1: R78.1 T1.8(RD-) U9.1(RXM1)
NetR79_1: R79.1 T1.3(TD-) U9.3(TXM1)
NetR82_2: R82.2 U9.18(SMTXD32)
NetR83_2: R83.2 U9.17(SMTXD33/EN_REFCLKO_3)
NetR84_1: R84.1 T1.10(CMT)
NetR86_1: R86.1 T1.15(CMT)
NetR89_1: R89.1 T2.6(RD+) U9.9(RXP2)
NetR90_1: R90.1 T2.8(RD-) U9.8(RXM2)
NetR91_1: R91.1 T2.1(TD+) U9.12(TXP2)
NetR92_1: R92.1 T2.3(TD-) U9.11(TXM2)
NetR93_2: R93.2 U9.26(SMRXD33/REFCLKO_3)
NetR98_1: R98.1 T2.10(CMT)
NetR99_1: R99.1 T2.15(CMT)

Not connected (* = marked no-connect by the designer): ENC1 CLKo* SCK* WOL*; T1 4(NC)* 5(NC)* 12(NC)* 13(NC)*; T2 4(NC)* 5(NC)* 12(NC)* 13(NC)*; U9 13(NC)* 15(X2)* 24(SMTXER3/MII_LINK_3)* 27(SMRXD32)* 30(SMRXC3)* 33(SCOL3)* 34(SCRS3)*

### Notes on the sheet
- THIS DOCUMENT AND THE DATA DISCLOSED HEREIN OR
- HEREWITH IS THE PROPERTY OF ALTIUM LIMITED AND MAY
- DWG NO:
- REVISION
- REV:
- DESCRIPTION
- DATE
- APPROVED
- BE FREELY DISTRIBUTED IN WHOLE. NO RIGHTS ARE
- RESERVED OR EXPRESS OR IMPLIED WARANTEE GIVEN.
- ENG:
- APPROVALS
- PROJECT
- DSN:
- CHK:
- REFERENCE DOCUMENTS
- PROJECT REVISION:
- TITLE
- DOCUMENT REVISION:
- DESIGN ITEM:
- BOM:
- FAB DWG:
- PCB DWG:
- ASSY DWG:
- SCALE:
- A3
- SIZE
- CAGE CODE
- FILE NAME
- DWG NO.
- SHEET
- OF
- REV

### Library data of the parts
1 = CMP-003-00019-2: Ceramic SMD Crystal, 24 MHz, +/- 20 ppm, 18 pF, -20 to 70 degC, 4-Pin SMD, RoHS, Tape and Reel; Manufacturer: Abracon; Load Capacitance: 18pF; Frequency Tolerance: 20ppm; ESR: 50; Resistance: 50Ohm; Frequency: 24MHz; Package Quantity: 1000; Packaging: TapeandReel; RoHS Compliant: True; Package Description: 4-Pin Surface Mount Device, Body 5 x 3.2 mm; Mounting Technology: SM; Pins: 4; Datasheet URL: http://www.abracon.com/Resonators/abm3b.pdf; Tolerance: 20ppm; Manufacturer URL: http://www.abracon.com/; Max Operating Temperature: 70°C; Datasheet Version: Aug-15; Min Operating Temperature: -20°C; Package Reference: ABM3B; Case/Package: CSMD
C95 = CMP-001-00007-6: Chip Capacitor, 1 uF, +/- 10%, 50 V, 0805 (2012 Metric); Capacitor Type: Ceramic; Voltage Rating: 50V; Case/Package: 0805; Max Operating Temperature: 125°C; Min Operating Temperature: -55°C; Mounting Technology: SM; Pins: 2; RoHS Compliant: True; Tolerance: 10%
C96 = CMP-001-00018-6: Chip Capacitor, 100 nF, +/- 10%, 50 V, 0805 (2012 Metric); Capacitor Type: Ceramic; Voltage Rating: 50V; Case/Package: 0805; Max Operating Temperature: 125°C; Min Operating Temperature: -55°C; Mounting Technology: SM; Pins: 2; RoHS Compliant: True; Tolerance: 10%
C97 C101 C103-C105 C107 C108 C112 C113 C117 C118 = CMP-03422-000748-1: CAP CER 0.1UF 10V X7R 0402; Manufacturer: YAGEO; Manufacturer Part Number: CC0402KRX7R6BB104; Tolerance: 0.1; Value: 100 nF; Temperature Coefficient: 30ppm/°C; Material: Ceramic; Automotive Grade: NA; Ipc Land Pattern Name: CAPC10050X50; Temperature Range Low: -55°C; Temperature: -55°C to +125°C; Footprint Url: http://www.yageo.com/exep/pages/download/literatures/UPY-C_GEN_24.pdf; Device Class L2: Capacitors; ComponentLink2Description: Datasheet; Temperature Characteristic: X7R; Height: 0.55mm; Mouser Description: Multilayer Ceramic Capacitors MLCC - SMD/SMT 100nF 10V X7R 10%; Temperature Range High: +125°C; Package: CC0402; Digikey Description: CAP CER 0.1UF 10V X7R 0402; Automotive: No; Voltage Rating: 10 V; Octopart: https://octopart.com/cc0402krx7r6bb104-yageo-8376509; Capacitance: 100 nF; ComponentLink2URL: http://www.yageo.com/documents/recent/UPY-GP_NP0_16V-to-50V_16.pdf; Category: Cap; Lead Free: Yes; Device Class L3: Ceramic Capacitors; RoHS: TRUE; Device Class L1: Passive Components
C98 C100 C102 C106 = CMP-1038-02268-1: CAP 22uF 10V ±10% 1210 (3225 Metric) Thickness 2.8mm SMD; Case-Metric: 3225; Case-EIA: 1210; Tolerance: Â±10%; Max Thickness: 2.8 mm; Value: 22uF; Technology: SMT; Rated Voltage: 10 V
C99 C109-C111 C114 = CMP-1037-04967-1: CAP 10uF 10V ±10% 1206 (3216 Metric) Thickness 1.9mm SMD; Tolerance: Â±10%; Case-Metric: 3216; Case-EIA: 1206; Rated Voltage: 10 V; Max Thickness: 1.9 mm; Technology: SMT; Value: 10uF
C115 C116 C119 C120 = CMP-03020-034681-1: CAP CER 1000PF 2KV X7R 1206; Tolerance: 10%; Capacitance: 1nF; Dissipation Factor: 2.5%; Dielectric Material: Ceramic; Voltage Rating (DC): 2.5kV; Voltage: 2kV; REACH SVHC: No SVHC; Height: 1.6mm; Construction: Flat; Case/Package: 1206; Series: C; Mount: Surface Mount; RoHS Compliant: Yes; Package Quantity: 1; Length: 3.2mm; Width: 0.063inch; Voltage Rating: 2kV; Min Operating Temperature: -55°C; Case Code (Metric): 3216; Termination: SMD/SMT; Number of Pins: 2; Case Code (Imperial): 1206; Packaging: Tape and Reel; Dielectric: X7R; Thickness: 0.069inch; Depth: 1.6mm; Radiation Hardening: No; Max Operating Temperature: 125°C
C121 = CMP-2010-00236-1: Part Number: 0201ZD103KAT2A; Manufacturer: AVX Interconnect / Elco
CC1 = CMP-1038-01657-2: General Purpose Ceramic Capacitor, 1210, 100nF, 10%, X7R, +15%, 50V; Insulation Resistance: 100GR; Dissipation Factor: 2.5%; Number of Pins: 2; Max Operating Temperature: 125°C; Tolerance: 10%; Length: 3.2mm; Width: 0.098inch; Dielectric: X7R; Thickness: 0.037inch; Height: 0.94mm; Capacitance: 100nF; Voltage Rating: 50V; Voltage: 50V; Construction: Flat; Termination: SMD/SMT; Depth: 2.5mm; Mount: Surface Mount; Series: -; Min Operating Temperature: -55°C; Case Code (Imperial): 1210; Packaging: Tape and Reel; RoHS Compliant: Yes; Voltage Rating (DC): 50V; Case/Package: 1210; Package Quantity: 1; REACH SVHC: No SVHC; Case Code (Metric): 3225; Lead Free: Lead Free
D14 = CMP-004-00002-2: Fast Switching Diode, 75 V, 0.3 A, -65 to 150 degC, 2-Pin SOD323, RoHS, Tape and Reel; Manufacturer: Diodes Inc; Peak Reverse Current: 1uA; Max Surge Current: 2A; Elements: 1; Forward Current: 300mA; Recovery Time: 4ns; Forward Voltage: 1.25V; Datasheet Version: Rev. 25-2, 03/2016; Case/Package: SOD; Min Operating Temperature: -65°C; RoHS Compliant: True; Max Operating Temperature: 150°C; Manufacturer URL: http://www.diodes.com/; Pins: 2; Package Quantity: 3000; Datasheet URL: http://www.diodes.com/datasheets/ds30097.pdf; Packaging: TapeandReel; Package Description: 2-Pin Small Outline Diode, Body 1.7 x 1.3 mm; Mounting Technology: SM; Package Reference: SOD323-2
ENC1 = CMP-031-00007-1
FB1 FB2 = GZ1608D601TF: Ferrite Bead; Manufacturer_Name: SUNLORD; Datasheet Link: https://datasheet.lcsc.com/szlcsc/Sunlord-GZ1608D601TF_C1002.pdf; Height: 0.95mm; Manufacturer_Part_Number: GZ1608D601TF
J5 J6 = CMP-09396-000004-1: CONN RCPT FMALE 8POS GOLD SOLDER; Number of Positions: 8; Voltage Rating: 48V; Ratings: IP67; Current Rating: 500mA; Gender: Female; Wire/Cable Diameter: 6mm; Connector Type: Receptacle; Fastening Type: Twist; Packaging: Bulk; Housing Material: Zinc; Contact Plating: Gold; Lead Free: Lead Free; REACH SVHC: No SVHC; Orientation: Straight; Max Operating Temperature: 70°C; Mount: Panel; Number of Contacts: 8; Termination: Solder; Series: PLUSCON; Min Operating Temperature: -40°C; Thread Size: M12; Package Quantity: 20; Contact Gender: Female
LED3-LED6 = CMP-007-00041-3: as LED1 on sheet BatteryManagementSystem; Case/Package: 0402; Colour: Green; Mounting Technology: SMT; Pins: 2; RoHS Compliant: Yes
R71 = CMP-009-00002-5: Chip Resistor, 0 Ohm, +/- 5%, 0.25 W, -55 to 155 degC, 1206 (3216 Metric); Voltage Rating: 200V; Power: 250mW; Tolerance: 5%; Min Operating Temperature: -55°C; Mounting Technology: SM; Max Operating Temperature: 155°C; Case/Package: 1206; RoHS Compliant: True; Pins: 2
R72 R81-R83 R85 R93 R94 R96 = CMP-2000-04818-3: RES 10KΩ 1.00% 0.1W 0603; Power Rating: 100mW; Tolerance: 1%; Resistance: 10kR; Voltage Rating: 50V; Temperature Coefficient: 100ppm/°C; Ratings: AEC-Q200; Case Code (Metric): 1608; Max Power Dissipation: 100mW; Height: 0.45mm; Package Quantity: 1; Max Operating Temperature: 155°C; Resistor Type: Thick Film; Depth: 0.8mm; RoHS Compliant: Yes; Min Operating Temperature: -55°C; Packaging: Tape and Reel; Number of Terminations: 2; Length: 1.6mm; Features: Moisture Resistant; Military Standard: Not; Case Code (Imperial): 0603; Size Code: 0603; Termination: SMD/SMT; Case/Package: 0603; Mount: Surface Mount; Width: 0.8mm; Lead Free: Lead Free; Series: AC; Construction: Rectangular
R73 R80 = CMP-2001-00644-1: Part Number: ERA6AEB472V; Manufacturer: Panasonic
R74 R95 = CMP-009-00014-5: as R53 on sheet BatteryManagementSystem; Mounting Technology: SM; Pins: 2; Case/Package: 0603; Min Operating Temperature: -55°C; RoHS Compliant: True; Max Operating Temperature: 155°C
R75 = CMP-2001-04399-1: Part Number: ERJ-6ENF1182V; Manufacturer: Panasonic
R76-R79 R89-R92 = CMP-2000-04466-2: RES SMD 49.9 OHM 0.1% 1/10W 0603; Manufacturer: Yageo; Manufacturer Part Number: RT0603BRD0749R9L; Voltage Rating: 75V; Temperature Coefficient: 25 ppm/°C; Tolerance: 0.001; Power Rating: 0.1W; Resistance: 49.9Ω; Mouser Description: Res Thin Film 0603 49.9 Ohm 0.1% 1/10W ±25ppm/°C Molded SMD SMD Paper T/R; Category: Res; RoHS: TRUE; Digikey Description: RES SMD 49.9 OHM 0.1% 1/10W 0603; Lead Free: Yes; ComponentLink2URL: http://www.yageo.com/documents/recent/PYu-RT_1-to-0.01_RoHS_L_9.pdf; Temperature Range High: +155°C; Footprint Url: http://www.yageo.com/exep/pages/download/literatures/PYu-R_Mount_10.pdf; Series: RT; Composition: Thin Film; Package: RT0603; Height: 0.55mm; Device Class L3: Chip SMD Resistors; Temperature Range Low: -55°C; Temperature: -55°C to +155°C; Value: 49.9Ω; Automotive: No; Ipc Land Pattern Name: RESC16080X45; Device Class L2: Resistors; Octopart: https://octopart.com/rt0603brd0749r9l-yageo-1274115; Device Class L1: Passive Components; ComponentLink2Description: Datasheet
R84 R86-R88 R98-R100 R102 = CMP-03412-022448-1: RES SMD 75 OHM 0.5% 1/10W 0603; Manufacturer Part Number: RT0603DRE0775RL; Manufacturer: Yageo; Temperature Coefficient: 50 ppm/°C; Power Rating: 0.1W; Tolerance: 0.005; Voltage Rating: 75V; Temperature Range Low: -55°C; ComponentLink2URL: http://www.yageo.com/documents/recent/PYu-RT_1-to-0.01_RoHS_L_9.pdf; Device Class L3: Chip SMD Resistors; Ipc Land Pattern Name: RESC16080X45; Temperature Range High: +155°C; Footprint Url: http://www.yageo.com/exep/pages/download/literatures/PYu-R_Mount_10.pdf; Device Class L2: Resistors; ComponentLink2Description: Datasheet; Category: Res; Temperature: -55°C to +155°C; Digikey Description: RES SMD 75 OHM 0.5% 1/10W 0603; Value: 75Ω; Composition: Thin Film; Resistance: 75Ω; Lead Free: Yes; Package: RT0603; Height: 0.55mm; RoHS: TRUE; Automotive: No; Series: RT; Octopart: https://octopart.com/rt0603dre0775rl-yageo-1170737; Device Class L1: Passive Components
R97 R101 R103 R104 = CMP-03412-006815-1: RES SMD 220 OHM 1% 1/10W 0603; Manufacturer Part Number: RT0603FRE07220RL; Manufacturer: Yageo; Temperature Coefficient: 50 ppm/°C; Tolerance: 0.01; Power Rating: 0.1W; Voltage Rating: 75V; RoHS: TRUE; ComponentLink2URL: http://www.yageo.com/documents/recent/PYu-RT_1-to-0.01_RoHS_L_9.pdf; Resistance: 220Ω; Digikey Description: RES SMD 220 OHM 1% 1/10W 0603; Height: 0.55mm; Composition: Thin Film; Octopart: https://octopart.com/rt0603fre07220rl-yageo-39861932; Temperature: -55°C to +155°C; Series: RT; Package: RT0603; Category: Res; Mouser Description: Thin Film Resistors 1/10W 220 ohm 1% 50ppm; ComponentLink2Description: Datasheet; Ipc Land Pattern Name: RESC16080X45; Temperature Range Low: -55°C; Lead Free: Yes; Device Class L2: Resistors; Footprint Url: http://www.yageo.com/exep/pages/download/literatures/PYu-R_Mount_10.pdf; Device Class L3: Chip SMD Resistors; Value: 220Ω; Device Class L1: Passive Components; Automotive: No; Temperature Range High: +155°C
RC1 = CMP-009-00001-5: Chip Resistor, 0 Ohm, +/- 1%, 125 mW, -55 to 155 degC, 0805 (2012 Metric); Voltage Rating: 150V; Power: 125mW; Mounting Technology: SM; Max Operating Temperature: 155°C; Case/Package: 0805; RoHS Compliant: True; Pins: 2; Min Operating Temperature: -55°C; Tolerance: 1%
T1 T2 = CMP-2000-05323-2: MODULE XFRMR SGL ETHR LAN 16SOIC; Turns Ratio: 1:1; Insertion Loss: -1dB; Isolation Voltage: 1.5kV; DC Resistance (DCR): 1.5R; Return Loss: -12dB; Shielding: Unshielded; Lead/Base Style: Gull Wing; Series: -; Depth: 9.53mm; Radiation Hardening: No; Height - Seated (Max): 6.22mm; Package Quantity: 40; Mount: Surface Mount; Width: 7.11mm; Lead Free: Lead Free; Number of Pins: 16; RoHS Compliant: Yes; Termination: SMD/SMT; Min Operating Temperature: -40°C; Packaging: Rail/Tube; Height: 5.97mm; Case/Package: Module; Max Operating Temperature: 85°C; Length: 12.7mm
TP29-TP32 = CMP-00028-00002-2: 0.6mm round; Pins: 1
U9 = CMP-06281-000067-1: IC ETHERNET SWITCH 3PORT 48-LQFP; Number of Transceivers: 3; Max Supply Current: 114mA; Nominal Supply Current: 85mA; Data Rate: 100Mbps; Min Supply Voltage: 1.71V; Supply Voltage-Nom: 3.3V; Max Supply Voltage: 3.465V; Interface: I2C; Min Operating Temperature: -40°C; Lead Free: Lead Free; Width: 7.1mm; Packaging: Tray; Mount: Surface Mount; Series: -; Radiation Hardening: No; Case/Package: LQFP; Number of Ports: 3; Height: 1.45mm; Length: 7.1mm; RoHS Compliant: Yes; Package Quantity: 250; Number of Functions: 3; Supply Current: 85mA; Number of Pins: 48; Max Operating Temperature: 85°C; REACH SVHC: No SVHC; Operating Supply Voltage: 3.3V

## Nets that join several sheets
5V: AD7173adcModule (10 pins), PowerManagementModule (IC2.1 R2.2 TP4.1), BoardIOModule (17 pins)
24Vin: U_TopSheet/U_LoadSwitches/SolenoidDriver1 (C55_1.2 IC6_1.7), U_TopSheet/U_LoadSwitches/SolenoidDriver2 (C55_2.2 IC6_2.7), U_TopSheet/U_LoadSwitches/SolenoidDriver3 (C55_3.2 IC6_3.7), U_TopSheet/U_LoadSwitches/SolenoidDriver4 (C55_4.2 IC6_4.7), U_TopSheet/U_LoadSwitches/PyroDriver1 (C91_1.2 C92_1.2 R62_1.2 U7_1.7), U_TopSheet/U_LoadSwitches/PyroDriver2 (C91_2.2 C92_2.2 R62_2.2 U7_2.7), U_TopSheet/U_LoadSwitches/PyroDriver3 (C91_3.2 C92_3.2 R62_3.2 U7_3.7), PowerManagementModule (10 pins), BoardIOModule (8 pins)
GND: STM32 (34 pins), AD7173adcModule (39 pins), FlashMemorySchDoc (10 pins), U_TopSheet/U_LoadSwitches/SolenoidDriver1 (C52_1.1 IC6_1.5 R18_1.1), U_TopSheet/U_LoadSwitches/SolenoidDriver2 (C52_2.1 IC6_2.5 R18_2.1), U_TopSheet/U_LoadSwitches/SolenoidDriver3 (C52_3.1 IC6_3.5 R18_3.1), U_TopSheet/U_LoadSwitches/SolenoidDriver4 (C52_4.1 IC6_4.5 R18_4.1), U_TopSheet/U_LoadSwitches/PyroDriver1 (6 pins), U_TopSheet/U_LoadSwitches/PyroDriver2 (6 pins), U_TopSheet/U_LoadSwitches/PyroDriver3 (6 pins), PowerManagementModule (36 pins), BoardIOModule (50 pins), BatteryManagementSystem (20 pins), CAN_Module (C92.2 C93.2 C94.2 U8.2), KSZ8863EthernetSwitch_RMII (33 pins)
STM32VDD: STM32 (40 pins), AD7173adcModule (12 pins), FlashMemorySchDoc (7 pins), U_TopSheet/U_LoadSwitches/SolenoidDriver1 (C52_1.2 IC6_1.1), U_TopSheet/U_LoadSwitches/SolenoidDriver2 (C52_2.2 IC6_2.1), U_TopSheet/U_LoadSwitches/SolenoidDriver3 (C52_3.2 IC6_3.1), U_TopSheet/U_LoadSwitches/SolenoidDriver4 (C52_4.2 IC6_4.1), U_TopSheet/U_LoadSwitches/PyroDriver1 (R65_1.1), U_TopSheet/U_LoadSwitches/PyroDriver2 (R65_2.1), U_TopSheet/U_LoadSwitches/PyroDriver3 (R65_3.1), PowerManagementModule (9 pins), BoardIOModule (C23.2 C24.2 J1.9 P3.1), BatteryManagementSystem (Rpg1.1), CAN_Module (C92.1 C93.1 U8.3), KSZ8863EthernetSwitch_RMII (27 pins)
AIN8: AD7173adcModule (R46.1), BoardIOModule (JADC2.14)
AIN9: AD7173adcModule (R37.1), BoardIOModule (JADC2.15)
AIN10: AD7173adcModule (R36.1), BoardIOModule (JADC2.17)
AIN11: AD7173adcModule (R35.1), BoardIOModule (JADC2.18)
AIN12: AD7173adcModule (R34.1), BoardIOModule (JADC2.20)
AIN13: AD7173adcModule (R33.1), BoardIOModule (JADC2.21)
AIN14: AD7173adcModule (R32.1), BoardIOModule (JADC2.23)
AIN15: AD7173adcModule (R23.1), BoardIOModule (JADC2.24)
CANH: TopSheet (P1.1), CAN_Module (R70.1 U8.7)
CANL: TopSheet (P1.2), CAN_Module (R70.2 U8.6)
ETH_RXD0: STM32 (IC5.127), KSZ8863EthernetSwitch_RMII (U9.20)
ETH_RXD1: STM32 (IC5.128), KSZ8863EthernetSwitch_RMII (U9.19)
ETH_TX_EN: STM32 (IC5.126), KSZ8863EthernetSwitch_RMII (R81.1 U9.25)
ETH_TXD0: STM32 (IC5.44), KSZ8863EthernetSwitch_RMII (U9.29)
ETH_TXD1: STM32 (IC5.45), KSZ8863EthernetSwitch_RMII (R85.2 U9.28)
FDCAN2_RX: STM32 (IC5.103), CAN_Module (R68.1)
FDCAN2_TX: STM32 (IC5.104), CAN_Module (R69.1)
JTCK: STM32 (IC5.109), BoardIOModule (P3.4 TP10.1)
JTDI: STM32 (IC5.110), BoardIOModule (P3.8 TP12.1)
JTDO: STM32 (IC5.133), BoardIOModule (P3.6 TP11.1)
JTMS: STM32 (IC5.105), BoardIOModule (P3.2 TP9.1)
LOAD_1: U_TopSheet/U_LoadSwitches/SolenoidDriver1 (C54_1.2 D8_1.1 IC6_1.6 TP15_1.1), BoardIOModule (JValve1.5 JValve1.18)
LOAD_2: U_TopSheet/U_LoadSwitches/SolenoidDriver2 (C54_2.2 D8_2.1 IC6_2.6 TP15_2.1), BoardIOModule (JValve1.6 JValve1.19)
LOAD_3: U_TopSheet/U_LoadSwitches/SolenoidDriver3 (C54_3.2 D8_3.1 IC6_3.6 TP15_3.1), BoardIOModule (JValve1.8 JValve1.20)
LOAD_4: U_TopSheet/U_LoadSwitches/SolenoidDriver4 (C54_4.2 D8_4.1 IC6_4.6 TP15_4.1), BoardIOModule (JValve1.10 JValve1.22)
LOAD_5: U_TopSheet/U_LoadSwitches/PyroDriver1 (6 pins), BoardIOModule (JPyro1.1 JPyro1.2 JPyro1.14 JPyro1.15)
LOAD_6: U_TopSheet/U_LoadSwitches/PyroDriver2 (6 pins), BoardIOModule (JPyro1.6 JPyro1.7 JPyro1.19 JPyro1.20)
LOAD_7: U_TopSheet/U_LoadSwitches/PyroDriver3 (6 pins), BoardIOModule (JValve1.1 JValve1.2 JValve1.14)
NetBMS1_7: BoardIOModule (J2.2), BatteryManagementSystem (6 pins)
NetBMS1_9: BoardIOModule (J3.2), BatteryManagementSystem (7 pins)
NetC3_1: PowerManagementModule (8 pins), BatteryManagementSystem (7 pins)
NetJADC1_14: AD7173adcModule (R22.1), BoardIOModule (JADC1.14)
NetJADC1_15: AD7173adcModule (R21.1), BoardIOModule (JADC1.15)
NetJADC1_17: AD7173adcModule (R20.1), BoardIOModule (JADC1.17)
NetJADC1_18: AD7173adcModule (R19.1), BoardIOModule (JADC1.18)
NetJADC1_20: AD7173adcModule (R50.1), BoardIOModule (JADC1.20)
NetJADC1_21: AD7173adcModule (R49.1), BoardIOModule (JADC1.21)
NetJADC1_23: AD7173adcModule (R48.1), BoardIOModule (JADC1.23)
NetJADC1_24: AD7173adcModule (R47.1), BoardIOModule (JADC1.24)
NRST: STM32 (IC5.116 R15.1 TP14.1), BoardIOModule (P3.10 TP13.1)